# EAGLE design 3-Axis CNC Board v1.0 (EAGLE 6.5.0)
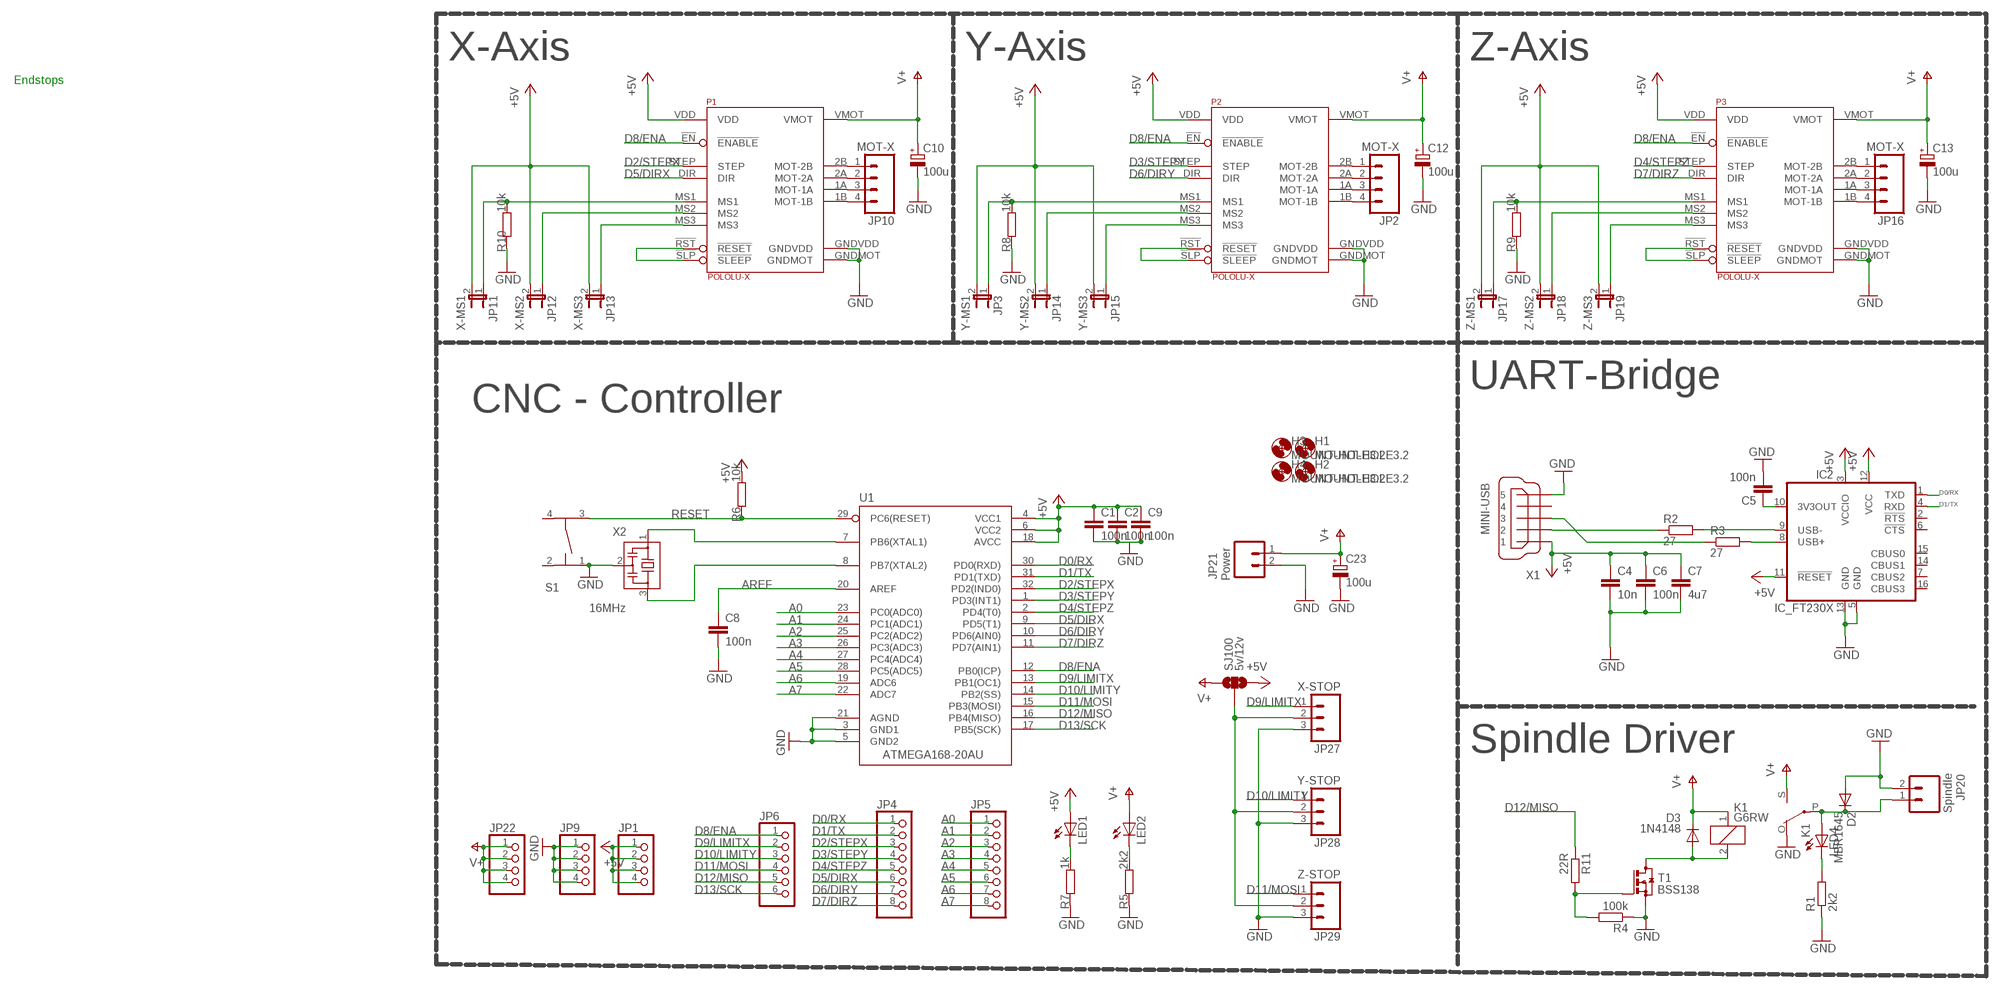
[diagram p0: schematic, sheet 1]

## Parts
C1  100n  C-EUC0805K  [C0805K]
C2  100n  C-EUC0805K  [C0805K]
C4  10n  C-EUC0805K  [C0805K]
C5  100n  C-EUC0805K  [C0805K]
C6  100n  C-EUC0805K  [C0805K]
C7  4u7  C-EUC0805K  [C0805K]
C8  100n  C-EUC0805K  [C0805K]
C9  100n  C-EUC0805K  [C0805K]
C10  100u  CPOL-EUUD-6,3X7,7  [UD-6,3X7,7_NICHICON]
C12  100u  CPOL-EUUD-6,3X7,7  [UD-6,3X7,7_NICHICON]
C13  100u  CPOL-EUUD-6,3X7,7  [UD-6,3X7,7_NICHICON]
C23  100u  CPOL-EUUD-6,3X7,7  [UD-6,3X7,7_NICHICON]
D2  MBR1645  BYT08P  [TO220ACS]
D3  1N4148  1N4148HOMO  [R0805]
H1  MOUNT-HOLE3.2  [3,2]
H2  MOUNT-HOLE3.2  [3,2]
H3  MOUNT-HOLE3.2  [3,2]
H4  MOUNT-HOLE3.2  [3,2]
IC2  IC_FT230X  IC_FT230X-SSOP-16  [SSOP-16-FTDI]
JP1  PINHD-1X4_2.54  [1X04]
JP2  MOT-X  M04POLAR  [MOLEX-1X4]
JP3  Y-MS1  JUMPER-2PTH  [1X02]
JP4  PINHD-1X8_2.54  [1X08]
JP5  PINHD-1X8_2.54  [1X08]
JP6  PINHD-1X6_2.54  [1X06]
JP9  PINHD-1X4_2.54  [1X04]
JP10  MOT-X  M04POLAR  [MOLEX-1X4]
JP11  X-MS1  JUMPER-2PTH  [1X02]
JP12  X-MS2  JUMPER-2PTH  [1X02]
JP13  X-MS3  JUMPER-2PTH  [1X02]
JP14  Y-MS2  JUMPER-2PTH  [1X02]
JP15  Y-MS3  JUMPER-2PTH  [1X02]
JP16  MOT-X  M04POLAR  [MOLEX-1X4]
JP17  Z-MS1  JUMPER-2PTH  [1X02]
JP18  Z-MS2  JUMPER-2PTH  [1X02]
JP19  Z-MS3  JUMPER-2PTH  [1X02]
JP20  Spindle  M025MM  [SCREWTERMINAL-5MM-2]
JP21  Power  M025MM  [SCREWTERMINAL-5MM-2]
JP22  PINHD-1X4_2.54  [1X04]
JP27  X-STOP  M03POLAR  [MOLEX-1X3]
JP28  Y-STOP  M03POLAR  [MOLEX-1X3]
JP29  Z-STOP  M03POLAR  [MOLEX-1X3]
K1  G6RW  [G6RW]
LED1  LEDCHIPLED_1206  [CHIPLED_1206]
LED2  LEDCHIPLED_1206  [CHIPLED_1206]
LED4  LEDCHIPLED_1206  [CHIPLED_1206]
P1  POLOLU-X  POLOLU-ALLEGRO  [POLOLU-ALLEGRO-PTH]
P2  POLOLU-X  POLOLU-ALLEGRO  [POLOLU-ALLEGRO-PTH]
P3  POLOLU-X  POLOLU-ALLEGRO  [POLOLU-ALLEGRO-PTH]
R1  2k2  R-EU_R1206  [R1206]
R2  27  R-EU_R1206  [R1206]
R3  27  R-EU_R1206  [R1206]
R4  100k  R-EU_R1206  [R1206]
R5  2k2  R-EU_R1206  [R1206]
R6  10k  R-EU_R1206  [R1206]
R7  1k  R-EU_R1206  [R1206]
R8  10k  R-EU_R1206  [R1206]
R9  10k  R-EU_R1206  [R1206]
R10  10k  R-EU_R1206  [R1206]
R11  22R  R-EU_R1206  [R1206]
S1  TASTER-9314_SMD  [TASTER-9314_SMD]
SJ100  5v/12v  SOLDERJUMPER_2WAYS  [SJ_3]
T1  BSS138  [SOT23-5L]
U1  ATMEGA168-20AU  [QFP032]
X1  MINI-USB  MINI-USB-32005-021-NODRILL  [32005-201_1]
X2  16MHz  CSTCE_G8M00G52A  [CSTCE_]

## Nets
+5V: C1.1 C2.1 C4.1 C6.1 C7.1 C9.1 IC2.3(VCCIO) IC2.11(!RESET) IC2.12(VCC) JP1.1 JP1.2 JP1.3 JP1.4 JP3.2 JP11.2 JP12.2 JP13.2 JP14.2 JP15.2 JP17.2 JP18.2 JP19.2 LED1.A P1.VDD P2.VDD P3.VDD R6.2 SJ100.3 U1.4(VCC1) U1.6(VCC2) U1.18(AVCC) X1.1
A0: JP5.1 U1.23(PC0(ADC0))
A1: JP5.2 U1.24(PC1(ADC1))
A2: JP5.3 U1.25(PC2(ADC2))
A3: JP5.4 U1.26(PC3(ADC3))
A4: JP5.5 U1.27(PC4(ADC4))
A5: JP5.6 U1.28(PC5(ADC5))
A6: JP5.7 U1.19(ADC6)
A7: JP5.8 U1.22(ADC7)
AREF: C8.1 U1.20(AREF)
D0/RX: IC2.1(TXD) JP4.1 U1.30(PD0(RXD))
D1/TX: IC2.4(RXD) JP4.2 U1.31(PD1(TXD))
D2/STEPX: JP4.3 P1.STEP U1.32(PD2(IND0))
D3/STEPY: JP4.4 P2.STEP U1.1(PD3(INT1))
D4/STEPZ: JP4.5 P3.STEP U1.2(PD4(T0))
D5/DIRX: JP4.6 P1.DIR U1.9(PD5(T1))
D6/DIRY: JP4.7 P2.DIR U1.10(PD6(AIN0))
D7/DIRZ: JP4.8 P3.DIR U1.11(PD7(AIN1))
D8/ENA: JP6.1 P1.!EN(!ENABLE) P2.!EN(!ENABLE) P3.!EN(!ENABLE) U1.12(PB0(ICP))
D9/LIMITX: JP6.2 JP27.1 U1.13(PB1(OC1))
D10/LIMITY: JP6.3 JP28.1 U1.14(PB2(SS))
D11/MOSI: JP6.4 JP29.1 U1.15(PB3(MOSI))
D12/MISO: JP6.5 R11.1 U1.16(PB4(MISO))
D13/SCK: JP6.6 U1.17(PB5(SCK))
D+: IC2.8(USB+) R3.2
D-: IC2.9(USB-) R2.2
ENDSTOP+V: JP27.2 JP28.2 JP29.2 SJ100.2
GND: C1.2 C2.2 C4.2 C5.2 C6.2 C7.2 C8.2 C9.2 C10.- C12.- C13.- C23.- D2.A IC2.5(GND) IC2.13(GND) JP9.1 JP9.2 JP9.3 JP9.4 JP20.2 JP21.2 JP27.3 JP28.3 JP29.3 K1.O(2:O) P1.GNDMOT P1.GNDVDD P2.GNDMOT P2.GNDVDD P3.GNDMOT P3.GNDVDD R1.1 R4.1 R5.1 R7.1 R8.1 R9.1 R10.1 S1.1 T1.5(S) U1.3(GND1) U1.5(GND2) U1.21(AGND) X1.5 X2.2
N$1: U1.8(PB7(XTAL2)) X2.3
N$2: U1.7(PB6(XTAL1)) X2.1
N$4: R3.1 X1.3
N$5: D3.A K1.2 T1.2(D)
N$6: D2.C JP20.1 K1.P(2:P) LED4.A
N$7: LED1.C R7.2
N$8: C5.1 IC2.10(3V3OUT)
N$9: R2.1 X1.2
N$10: LED4.C R1.2
N$11: R4.2 R11.2 T1.4(G)
N$17: LED2.C R5.2
RESET: R6.1 S1.3 U1.29(PC6(RESET))
V+: C10.+ C12.+ C13.+ C23.+ D3.K(C) JP21.1 JP22.1 JP22.2 JP22.3 JP22.4 K1.1 K1.S(2:S) LED2.A P1.VMOT P2.VMOT P3.VMOT SJ100.1
X-MOT-1A [power]: JP10.3 P1.1A(MOT-1A)
X-MOT-1A1 [power]: JP2.3 P2.1A(MOT-1A)
X-MOT-1A2 [power]: JP16.3 P3.1A(MOT-1A)
X-MOT-1B [power]: JP10.4 P1.1B(MOT-1B)
X-MOT-1B1 [power]: JP2.4 P2.1B(MOT-1B)
X-MOT-1B2 [power]: JP16.4 P3.1B(MOT-1B)
X-MOT-2A [power]: JP10.2 P1.2A(MOT-2A)
X-MOT-2A1 [power]: JP2.2 P2.2A(MOT-2A)
X-MOT-2A2 [power]: JP16.2 P3.2A(MOT-2A)
X-MOT-2B [power]: JP10.1 P1.2B(MOT-2B)
X-MOT-2B1 [power]: JP2.1 P2.2B(MOT-2B)
X-MOT-2B2 [power]: JP16.1 P3.2B(MOT-2B)
X-MS1: JP11.1 P1.MS1 R10.2
X-MS2: JP12.1 P1.MS2
X-MS3: JP13.1 P1.MS3
X-MS4: JP14.1 P2.MS2
X-MS5: JP15.1 P2.MS3
X-MS6: JP3.1 P2.MS1 R8.2
X-MS7: JP18.1 P3.MS2
X-MS8: JP19.1 P3.MS3
X-MS9: JP17.1 P3.MS1 R9.2
X-RESETSLEEP: P1.!RST(!RESET) P1.!SLP(!SLEEP)
X-RESETSLEEP1: P2.!RST(!RESET) P2.!SLP(!SLEEP)
X-RESETSLEEP2: P3.!RST(!RESET) P3.!SLP(!SLEEP)
Unconnected: IC2.2(!RTS) IC2.6(!CTS) IC2.7(CBUS2) IC2.14(CBUS1) IC2.15(CBUS0) IC2.16(CBUS3) S1.2 S1.4 X1.4

## Notes on the sheet
- X-Axis | Y-Axis | Z-Axis
- Endstops
- UART-Bridge
- CNC - Controller
- Spindle Driver

## Library data of the parts
C1 C2 C4-C9 = rcl:C-EU: CAPACITOR, European symbol
C10 C12 C13 C23 = rcl:CPOL-EU: POLARIZED CAPACITOR, European symbol
D2 = diode:BYT08P: DIODE ultra fast
D3 = belichter:1N4148: DIODE standard rectifier, 3 A, 50 V (Motorola)
H1-H4 = holes:MOUNT-HOLE: MOUNTING HOLE with drill center marker
IC2 = dp_devices:IC_FT230X: BASIC USB to UART IC
JP1 JP9 JP22 = pinhead-1:PINHD-1X4: PIN HEADER
JP2 JP10 JP16 = SparkFun:M04: Header 4 Standard 4-pin 0.1" header. Use with straight break away headers (SKU : PRT-00116), right angle break away headers (PRT-00553), swiss pins (PRT-00743), machine pins (PRT-00117), and female headers (PRT-00115). Molex polarized connector foot print use with SKU : PRT-08231 with associated crimp pins and housings.
JP3 JP11-JP15 JP17-JP19 = SparkFun:JUMPER-2: Jumper Basic 0.1" spaced jumper. Use with breakaway headers.
JP4 JP5 = pinhead-1:PINHD-1X8: PIN HEADER
JP6 = pinhead-1:PINHD-1X6: PIN HEADER
JP20 JP21 = SparkFun-Connectors:M02: Standard 2-pin 0.1" header. Use with - straight break away headers ( PRT-00116) - right angle break away headers (PRT-00553) - swiss pins (PRT-00743) - machine pins (PRT-00117) - female headers (PRT-00115) Molex polarized connector foot print use with: PRT-08233 with associated crimp pins and housings. 2.54_SCREWTERM for use with PRT-10571. 3.5mm Screw Terminal footprints for PRT-08084 5mm Screw Terminal footprints for use with PRT-08433
JP27-JP29 = SparkFun:M03: Header 3 Standard 3-pin 0.1" header. Use with straight break away headers (SKU : PRT-00116), right angle break away headers (PRT-00553), swiss pins (PRT-00743), machine pins (PRT-00117), and female headers (PRT-00115). Molex polarized connector foot print use with SKU : PRT-08232 with associated crimp pins and housings.
K1 = relay:G6RW: RELAY 1 x switch, Omron; OC_FARNELL: unknown; OC_NEWARK: unknown
LED1 LED2 LED4 = led:LED: LED OSRAM: - CHIPLED LG R971, LG N971, LY N971, LG Q971, LY Q971, LO R971, LY R971 LH N974, LH R974 LS Q976, LO Q976, LY Q976 LO Q996 - Hyper CHIPLED LW Q18S LB Q993, LB Q99A, LB R99A - SideLED LS A670, LO A670, LY A670, LG A670, LP A670 LB A673, LV A673, LT A673, LW A673 LH A674 LY A675 LS A676, LA A676, LO A676, LY A676, LW A676 LS A679, LY A679, LG A679 - Hyper Micro SIDELED® LS Y876, LA Y876, LO Y876, LY Y876 LT Y87S - SmartLED LW L88C, LW L88S LB L89C, LB L89S, LG L890 LS L89K, LO L89K, LY L89K LS L896, LA L896, LO L896, LY L896 - TOPLED LS T670, LO T670, LY T670, LG T670, LP T670 LSG T670, LSP T670, LSY T670, LOP T670, LYG T670 LG T671, LOG T671, LSG T671 LB T673, LV T673, LT T673, LW T673 LH T674 LS T676, LA T676, LO T676, LY T676, LB T676, LH T676, LSB T676, LW T676 LB T67C, LV T67C, LT T67C, LS T67K, LO T67K, LY T67K, LW E67C LS E67B, LA E67B, LO E67B, LY E67B, LB E67C, LV E67C, LT E67C LW T67C LS T679, LY T679, LG T679 LS T770, LO T770, LY T770, LG T770, LP T770 LB T773, LV T773, LT T773, LW T773 LH T774 LS E675, LA E675, LY E675, LS T675 LS T776, LA T776, LO T776, LY T776, LB T776 LHGB T686 LT T68C, LB T68C - Hyper Mini TOPLED® LB M676 - Mini TOPLED Santana® LG M470 LS M47K, LO M47K, LY M47K Source: http://www.osram.convergy.de LUXEON: - LUMILED® LXK2-PW12-R00, LXK2-PW12-S00, LXK2-PW14-U00, LXK2-PW14-V00 LXK2-PM12-R00, LXK2-PM12-S00, LXK2-PM14-U00 LXK2-PE12-Q00, LXK2-PE12-R00, LXK2-PE12-S00, LXK2-PE14-T00, LXK2-PE14-U00 LXK2-PB12-K00, LXK2-PB12-L00, LXK2-PB12-M00, LXK2-PB14-N00, LXK2-PB14-P00, LXK2-PB14-Q00 LXK2-PR12-L00, LXK2-PR12-M00, LXK2-PR14-Q00, LXK2-PR14-R00 LXK2-PD12-Q00, LXK2-PD12-R00, LXK2-PD12-S00 LXK2-PH12-R00, LXK2-PH12-S00 LXK2-PL12-P00, LXK2-PL12-Q00, LXK2-PL12-R00 Source: www.luxeon.com KINGBRIGHT: KA-3528ASYC Source: www.kingbright.com
P1-P3 = pololu-allegro:POLOLU-ALLEGRO
R1-R11 = rcl:R-EU_: RESISTOR, European symbol
S1 = SMD-taster:TASTER-9314_SMD
SJ100 = SparkFun:SOLDERJUMPER_2WAY: Solder Jumper 2 way solder jumper
T1 = belichter:BSS138
U1 = MySMD:ATMEGA168-20AU
X1 = con-cypressindustries:MINI-USB-: MINI USB-B Conector Source: www.cypressindustries.com
X2 = DragonLib:CSTCE_G: Resonator Source: murata.co.jp; MPN: CSTCE8M00G52-R0; OC_RS: 721-4827

## Board
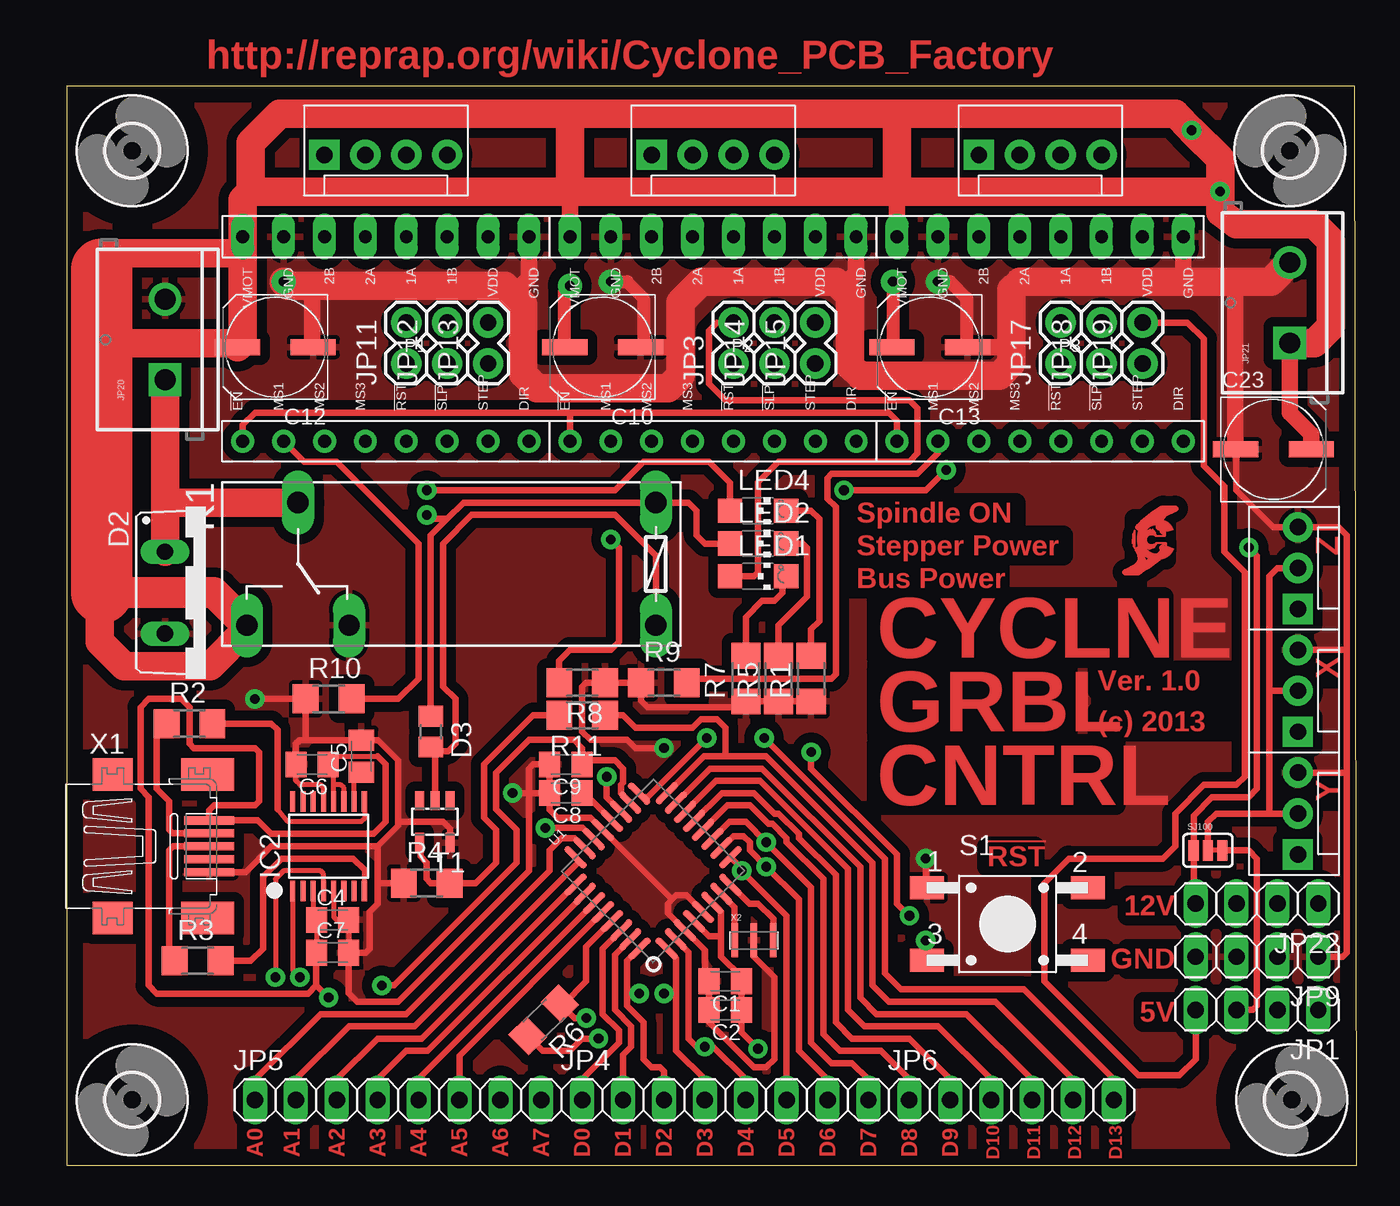
[diagram p1: board, top side]
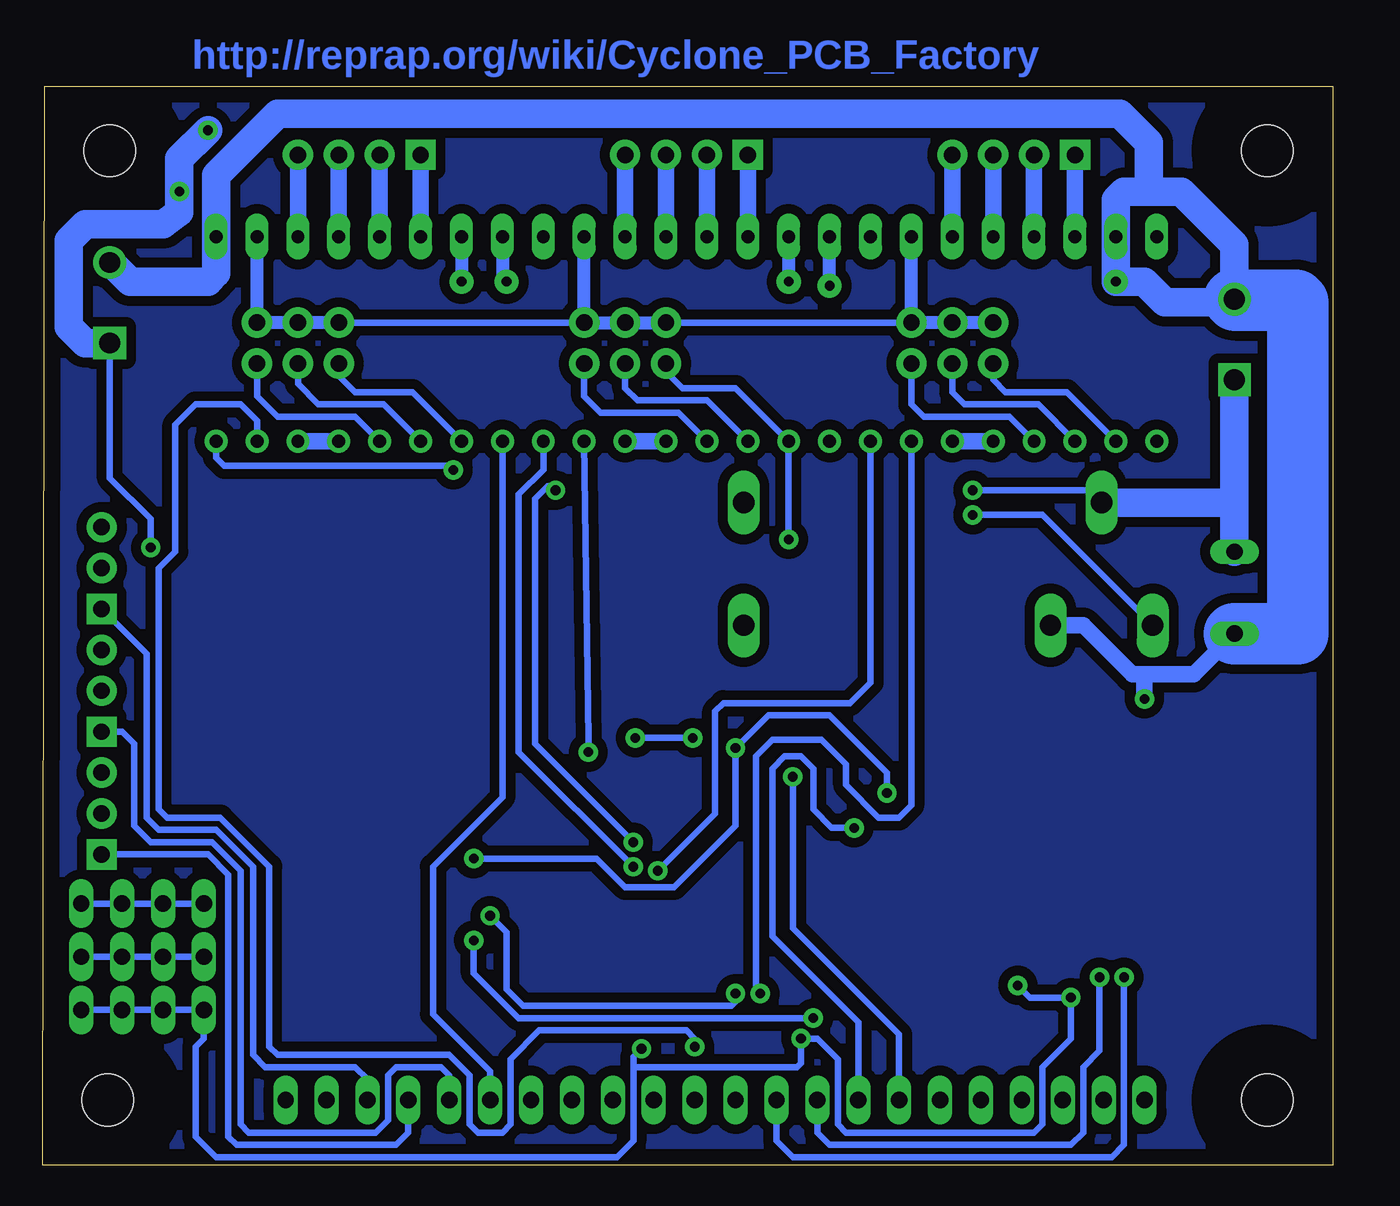
[diagram p2: board, bottom side, seen from below]

Size 80.12 x 66.98 mm. Coordinates in mm from the lower left corner, seen from the top.
Outline: 0,0 80.12,0 79.99,66.98 0,66.98 0,0
Copper layers (1*16): Top 0.035mm / dielectric 1.5mm / Bottom 0.035mm
Design rules "default *": minimum track width 10mil, minimum drill 24mil, track to track 2mil, track to pad 2mil, pad to pad 2mil, via to via 2mil, smd to smd 2mil, copper to edge 40mil, drill to drill 2mil, minimum pad ring 10mil, minimum via ring 8mil, stop-mask expansion 4mil, vias tented up to drill 0mil, thermal gap 10mil

### Footprints (pad centres in the part's own frame; a part is rotated, then mirrored left to right if it is on the bottom)
C0805K = smd 1.3 x 1.6: 1 -1,0; 2 1,0
UD-6,3X7,7_NICHICON = smd 2.8 x 1: + 2.35,0; - -2.35,0
TO220ACS = drill 1.016 long: A 2.54,-2.54; C -2.54,-2.54
R0805 = smd 1.3 x 1.5: A 0.95,0; K -0.95,0
3,2 = hole 3.2: 0,0
SSOP-16-FTDI = smd 0.32 x 1.26: 1 -2.223,-2.779; 2 -1.588,-2.779; 3 -0.953,-2.779; 4 -0.318,-2.779; 5 0.317,-2.779; 6 0.952,-2.779; 7 1.587,-2.779; 8 2.222,-2.779; 9 2.222,2.779; 10 1.587,2.779; 11 0.952,2.779; 12 0.317,2.779; 13 -0.318,2.779; 14 -0.953,2.779; 15 -1.588,2.779; 16 -2.223,2.779
1X04 = drill 1.016 long: 1 -3.81,0; 2 -1.27,0; 3 1.27,0; 4 3.81,0
MOLEX-1X4 = drill 1.016 pad 1.88 square: 1 0,0 | drill 1.016 pad 1.88: 2 2.54,0; 3 5.08,0; 4 7.62,0
1X02 = drill 1.016 pad 1.88: 1 0,0; 2 2.54,0
1X08 = drill 1.016 long: 1 -8.89,0; 2 -6.35,0; 3 -3.81,0; 4 -1.27,0; 5 1.27,0; 6 3.81,0; 7 6.35,0; 8 8.89,0
1X06 = drill 1.016 long: 1 -6.35,0; 2 -3.81,0; 3 -1.27,0; 4 1.27,0; 5 3.81,0; 6 6.35,0
SCREWTERMINAL-5MM-2 = drill 1.3 pad 2.032 square: 1 0,0 | drill 1.3 pad 2.032: 2 5,0
MOLEX-1X3 = drill 1.016 pad 1.88 square: 1 0,0 | drill 1.016 pad 1.88: 2 2.54,0; 3 5.08,0
G6RW = drill 1.321 long: 1 -12.7,-3.81; 2 -12.7,3.81; O 6.35,3.81; P 9.525,-3.81; S 12.7,3.81
CHIPLED_1206 = smd 1.5 x 1.5: A 0,-1.75; C 0,1.75
POLOLU-ALLEGRO-PTH = drill 0.8 pad 1.422 long: 1A 6.35,-1.27; 1B 6.35,-3.81; 2A 6.35,1.27; 2B 6.35,3.81; GNDMOT 6.35,6.35; GNDVDD 6.35,-8.89; VDD 6.35,-6.35; VMOT 6.35,8.89 | drill 0.8 pad 1.422: !EN -6.35,8.89; !RST -6.35,-1.27; !SLP -6.35,-3.81; DIR -6.35,-8.89; MS1 -6.35,6.35; MS2 -6.35,3.81; MS3 -6.35,1.27; STEP -6.35,-6.35
R1206 = smd 1.6 x 1.803: 1 -1.422,0; 2 1.422,0
TASTER-9314_SMD = smd 2.1 x 1.4: 1 -5,2.25; 2 5,2.25; 3 -5,-2.25; 4 5,-2.25
SJ_3 = smd 0.635 x 1.27: 1 -0.889,0; 2 0,0; 3 0.889,0
SOT23-5L = smd 0.55 x 1.2: 1 -0.95,-1.3; 2 0,-1.3; 3 0.95,-1.3; 4 0.95,1.3; 5 -0.95,1.3
QFP032 = smd 0.432 x 1.778: 1 0,0; 2 0.8,0; 3 1.599,0; 4 2.399,0; 5 3.199,0; 6 3.998,0; 7 4.798,0; 8 5.598,0; 17 5.588,8.001; 18 4.798,7.997; 19 3.998,7.997; 20 3.199,7.997; 21 2.399,7.997; 22 1.599,7.997; 23 0.799,7.997; 24 0,7.997 | smd 1.778 x 0.432: 9 6.807,1.194; 10 6.807,2.007; 11 6.807,2.794; 12 6.807,3.607; 13 6.807,4.394; 14 6.807,5.182; 15 6.807,5.994; 16 6.816,6.803; 25 -1.194,6.807; 26 -1.194,5.994; 27 -1.194,5.182; 28 -1.194,4.394; 29 -1.194,3.607; 30 -1.194,2.794; 31 -1.194,2.007; 32 -1.194,1.194
32005-201_1 = smd 3.1 x 0.5: 1 3,1.6; 2 3,0.8; 3 3,0; 4 3,-0.8; 5 3,-1.6 | smd 2.5 x 2: M1 -3,-4.45; M2 -3,4.45 | smd 3.3 x 2: M3 2.9,4.45; M4 2.9,-4.45
CSTCE_ = smd 0.4 x 2.1: 1 -1.2,0; 2 0,0; 3 1.2,0

### Placement (x,y rotation side)
C1  40.89,11.43 180 top
C2  40.89,9.65 180 top
C4  16.51,15.24 0 top
C5  18.29,25.4 90 top
C6  15.24,24.89 180 top
C7  16.51,13.21 0 top
C8  30.99,23.11 180 top
C9  30.99,24.89 180 top
C10  33.27,50.8 180 top
C12  12.95,50.8 180 top
C13  53.59,50.8 180 top
C23  74.93,44.45 0 top
D2  8.64,35.56 270 top
D3  22.61,26.92 270 top
H1  75.95,62.99 90 top
H2  4.06,62.99 0 top
H3  76.07,4.06 0 top
H4  4.06,4.06 0 top
IC2  16.26,19.81 0 top
JP1  73.91,9.65 180 top
JP2  36.32,62.74 0 top
JP3  41.4,49.78 90 top
JP4  40.89,4.06 0 top
JP5  20.57,4.06 0 top
JP6  58.67,4.06 0 top
JP9  73.91,12.95 180 top
JP10  16,62.74 0 top
JP11  21.08,49.78 90 top
JP12  23.62,49.78 90 top
JP13  26.16,49.78 90 top
JP14  43.94,49.78 90 top
JP15  46.48,49.78 90 top
JP16  56.64,62.74 0 top
JP17  61.72,49.78 90 top
JP18  64.26,49.78 90 top
JP19  66.8,49.78 90 top
JP20  6.1,48.77 90 top
JP21  75.95,51.05 90 top
JP22  73.91,16.26 180 top
JP27  76.45,26.92 90 top
JP28  76.45,19.3 90 top
JP29  76.45,34.54 90 top
K1  23.88,37.34 180 top
LED1  42.93,36.58 270 top
LED2  42.93,38.61 270 top
LED4  42.93,40.64 270 top
P1  19.81,51.31 90 top
P2  40.13,51.31 90 top
P3  60.45,51.31 90 top
R1  46.23,30.23 90 top
R2  7.62,27.43 0 top
R3  8.13,12.7 0 top
R4  22.35,17.53 0 top
R5  44.2,30.23 90 top
R6  29.61,9.04 225 top
R7  42.16,30.23 90 top
R8  32,29.97 180 top
R9  37.08,29.97 0 top
R10  16.26,28.96 0 top
R11  32,27.94 180 top
S1  58.42,14.99 0 top
SJ100  70.87,19.56 0 top
T1  22.86,21.34 180 top
U1  37.25,13.47 45 top
X1  5.84,19.81 0 top
X2  42.67,13.97 0 top

### Tracks (layer width: path | path; a pad name or v marks a point on that pad's centre or on a via)
+5V  (via drill 0.6 pad 1.2)
  Top 0.305: IC2.3 15.3,15.45 C4.1 C7.1 | IC2.12 16.57,23.62 | 16.57,23.62 16.57,24.56 C6.1 16.24,25.13 16.51,25.4 19.3,25.4 | IC2.11 17.21,23.43 17.02,23.62 16.57,23.62 | SJ100.3 70.87,19.56
  Top 0.406: U1.6 40.64,15.73 40.64,14.22 | U1.4 39.89,14.22 40.64,14.22 | 40.64,14.22 40.64,12.95 41.89,11.7 C1.1 C2.1 41.91,9.64 41.91,8.26 v42.93,7.24 | U1.18 34.42,23.09 34.42,23.62 34.54,23.75 34.54,24.64 34.04,25.15 32.51,25.15 32.26,24.89 C9.1 32,24.91 32,25.91 31.5,26.42 28.7,26.42 26.67,24.38 26.67,22.1 27.94,20.83 27.94,18.8 20.32,11.18 v19.56,11.18 | R6.2 29.53,7.11 31.24,7.11 32,7.87 v33.02,7.87 | 19.3,25.4 19.81,24.89 19.81,21.34 19.05,20.57 12.7,20.57 11.86,21.41 X1.1 8.84,22.05 9.14,22.35 11.68,22.35 11.94,22.61 11.94,25.65 11.68,25.91 7.87,25.91 7.62,26.16 7.62,28.45 7.11,28.96 5.08,28.96 4.57,28.45 4.57,23.37 5.08,22.86 5.08,11.18 5.59,10.67 14.99,10.67 15.49,11.18 | 15.49,11.18 15.49,13.19 C7.1 | 15.49,11.18 v16.26,10.41 | SJ100.3 73.41,19.56 73.91,19.05 73.91,9.91 73.66,9.65 JP1.3 | JP3.2 40.39,52.32 39.88,51.82 39.88,48.51 40.89,47.5 52.32,47.5 52.83,46.99 52.83,44.2 52.32,43.69 44.2,43.69 42.93,42.42 42.93,36.83 42.67,36.58 LED1.A | JP1.4 70.1,6.6 69.09,5.59 66.55,5.59 60.71,11.43 60.71,17.53 62.23,19.05 68.07,19.05 68.83,19.81 68.83,21.84 70.61,23.62 72.64,23.62 73.15,24.13 73.15,36.83 71.88,38.1 71.88,42.16 70.61,43.43 70.61,51.31 69.6,52.32 JP19.2
  Bottom 0.406: v19.56,11.18 18.8,10.41 v16.26,10.41 16.26,7.87 18.03,6.1 18.03,2.54 18.54,2.03 30.23,2.03 30.73,2.54 30.73,6.6 32,7.87 v33.02,7.87 33.02,6.35 33.27,6.1 43.43,6.1 | v42.93,7.24 43.43,6.73 43.43,6.1 | 43.43,6.1 43.43,1.52 44.45,0.51 69.34,0.51 70.61,1.78 70.61,7.37 70.1,7.87 JP1.4 JP1.3 JP1.2 JP1.1 | JP13.2 JP3.2 | JP15.2 JP17.2
  Bottom 0.813: JP17.2 JP18.2 JP19.2 P3.VDD | JP3.2 JP14.2 JP15.2 P2.VDD | JP11.2 JP12.2 JP13.2 P1.VDD
A0
  Top 0.406: JP5.1 11.68,5.33 15.75,9.4 21.08,9.4 29.97,18.29 29.97,19.56 30.73,20.32 31.53,20.32 U1.23
A1
  Top 0.406: U1.24 31.75,18.97 31.75,18.8 21.59,8.64 17.53,8.64 14.22,5.33 JP5.2
A2
  Top 0.406: U1.25 22.03,7.87 19.3,7.87 16.76,5.33 JP5.3
A3
  Top 0.406: U1.26 22.42,7.11 21.08,7.11 19.3,5.33 JP5.4
A4
  Top 0.406: U1.27 21.84,5.39 JP5.5
A5
  Top 0.406: U1.28 24.38,6.82 JP5.6
A6  (via drill 0.6 pad 1.2)
  Top 0.406: U1.19 33.53,22.85 v33.53,24.13
  Bottom 0.406: v33.53,24.13 33.53,14.73 26.92,8.13 JP5.7
A7  (via drill 0.6 pad 1.2)
  Top 0.406: U1.22 32.03,20.95 v29.72,20.95
  Bottom 0.406: v29.72,20.95 31.11,20.95 32.26,22.1 32.26,24.64 33.02,25.4 34.04,25.4 34.8,24.64 34.8,14.22 29.46,8.89 JP5.8
AREF
  Top 0.406: U1.20 32.24,23 C8.1
D0/RX  (via drill 0.6 pad 1.2)
  Top 0.305: IC2.1 14.03,12.13 v14.48,11.68
  Top 0.406: JP4.1 32,5.33 34.29,7.62 34.29,8.38 33.27,9.4 33.27,13.46 34.41,14.6 U1.30
  Bottom 0.406: v14.48,11.68 14.48,7.11 15.49,6.1 15.49,2.03 16.26,1.27 31.24,1.27 32,2.03 JP4.1
D1/TX  (via drill 0.6 pad 1.2)
  Top 0.305: IC2.4 15.94,18.1 15.75,18.29 13.46,18.29 12.95,17.78 v12.95,11.68
  Top 0.406: U1.31 34.04,13.09 34.04,9.65 35.05,8.64 35.05,7.37 34.54,6.86 JP4.2
  Bottom 0.406: v12.95,11.68 12.95,1.27 13.72,0.51 33.53,0.51 34.54,1.52 JP4.2
D2/STEPX  (via drill 0.6 pad 1.2)
  Top 0.406: U1.32 34.8,12.71 34.8,10.67 | 34.8,10.67 34.8,9.91 35.81,8.89 35.81,6.6 36.32,6.1 36.83,6.1 37.08,5.84 JP4.3 | v35.56,10.67 34.8,10.67
  Bottom 0.406: P1.STEP 26.16,22.35 26.92,21.59 28.19,21.59 30.23,23.62 30.23,24.89 31.75,26.42 34.8,26.42 35.81,25.4 35.81,10.92 v35.56,10.67
D3/STEPY  (via drill 0.6 pad 1.2)
  Top 0.406: JP4.4 39.62,5.33 37.85,7.11 37.85,10.67 | 37.85,10.67 37.85,12.87 U1.1 | 37.85,10.67 v37.08,10.67 | v52.32,15.49 51.56,16.26 51.56,19.3 46.23,24.64 v46.23,25.65
  Bottom 0.406: P2.STEP 46.23,26.42 v46.23,25.65 | v37.08,10.67 37.08,10.16 37.34,9.91 50.29,9.91 51.31,10.92 51.31,14.48 v52.32,15.49
D4/STEPZ  (via drill 0.6 pad 1.2)
  Top 0.406: JP4.5 42.16,5.33 40.13,7.37 v39.62,7.37 39.12,7.37 38.61,7.87 38.61,13.24 U1.2
  Bottom 0.406: v39.62,7.37 39.62,7.87 40.13,8.38 49.28,8.38 51.05,6.6 51.05,2.54 51.56,2.03 53.09,2.03 53.59,2.54 53.59,5.59 54.86,6.86 65.53,6.86 66.04,7.37 66.04,18.54 69.09,21.59 72.39,21.59 72.9,22.1 72.9,37.08 71.88,38.1 71.88,45.97 70.61,47.24 67.82,47.24 66.8,46.23 P3.STEP
D5/DIRX  (via drill 0.6 pad 1.2)
  Top 0.406: U1.9 41.91,18.44 v41.91,18.29 44.7,15.49 JP4.6
  Bottom 0.406: P1.DIR 28.7,29.97 29.97,28.7 37.85,28.7 38.35,28.19 38.35,21.84 v41.91,18.29
D6/DIRY  (via drill 0.6 pad 1.2)
  Top 0.406: JP4.7 47.24,5.33 45.47,7.11 45.47,16.51 v43.43,18.54 42.42,19.56 42.42,20.07 42.04,20.45 41.39,20.45 U1.10
  Bottom 0.406: v43.43,18.54 50.55,25.65 50.55,41.66 49.02,43.18 P2.DIR
D7/DIRZ  (via drill 0.6 pad 1.2)
  Top 0.406: JP4.8 49.78,5.33 48.77,6.35 47.5,6.35 46.23,7.62 46.23,17.27 v43.43,20.07 42.16,21.34 41.17,21.34 U1.11 | v54.61,43.18 53.34,41.91 v48.26,41.91
  Bottom 0.406: v43.43,20.07 49.53,26.16 49.53,41.4 48.77,42.16 v48.26,41.91 | P3.DIR 69.34,43.94 68.83,43.43 54.86,43.43 v54.61,43.18
D8/ENA
  Top 0.406: P1.!EN 10.92,45.97 11.68,46.74 31.24,46.74 | 31.24,46.74 51.05,46.74 51.56,46.23 P3.!EN | P2.!EN 31.24,46.74 | JP6.1 52.32,5.33 50.55,7.11 48.01,7.11 46.99,8.13 46.99,17.78 44.7,20.07 44.7,20.32 43.81,21.21 43.56,21.21 42.42,22.35 41.03,22.35 U1.12
  Bottom 0.406: P3.!EN 51.56,22.86 55.88,18.54 55.88,9.4 52.32,5.84 JP6.1
D9/LIMITX
  Top 0.406: JP6.2 54.86,5.33 52.32,7.87 48.77,7.87 47.75,8.89 47.75,18.03 45.47,20.32 45.47,20.57 44.2,21.84 43.94,21.84 42.67,23.11 40.68,23.11 U1.13
  Bottom 0.406: JP27.1 75.18,26.92 74.42,26.16 74.42,21.08 73.41,20.07 69.6,20.07 67.82,18.29 67.82,2.54 67.31,2.03 59.44,2.03 58.67,2.79 58.67,5.59 58.17,6.1 55.37,6.1 54.86,5.59 JP6.2
D10/LIMITY
  Top 0.406: JP6.3 57.4,5.33 54.1,8.64 49.53,8.64 48.51,9.65 48.51,18.41 43.05,23.88 40.33,23.88 U1.14
  Bottom 0.406: JP28.1 69.85,19.3 68.58,18.03 68.58,1.78 68.07,1.27 58.17,1.27 57.4,2.03 JP6.3
D11/MOSI
  Top 0.406: JP6.4 59.94,5.33 55.88,9.4 50.29,9.4 49.28,10.41 49.28,18.54 43.18,24.64 39.94,24.64 U1.15
  Bottom 0.406: JP29.1 73.66,31.75 73.66,21.59 72.9,20.83 69.34,20.83 67.06,18.54 67.06,6.86 66.29,6.1 60.71,6.1 59.94,5.33 JP6.4
D12/MISO
  Top 0.406: JP6.5 62.48,5.33 57.66,10.16 51.05,10.16 50.04,11.18 50.04,18.8 43.43,25.4 40.89,25.4 | 40.89,25.4 39.56,25.4 U1.16 | 40.89,25.4 40.89,27.18 40.39,27.69 39.37,27.69 38.86,27.18 35.31,27.18 34.54,27.94 R11.1
D13/SCK  (via drill 0.6 pad 1.2)
  Top 0.406: JP6.6 65.02,5.33 59.44,10.92 51.82,10.92 50.8,11.94 50.8,19.05 v43.31,26.54 | v39.75,26.54 36.07,22.86 35.76,22.86 U1.17
  Bottom 0.406: v39.75,26.54 v43.31,26.54
D+
  Top 0.305: IC2.8 18.48,18.35 18.29,18.54
  Top 0.406: R3.2 11.43,12.7 12.19,13.46 12.19,17.91 13.34,19.05 17.78,19.05 18.48,18.35
D-
  Top 0.305: IC2.9 18.48,21.53 18.29,21.34 13.72,21.34 13.08,22.1
  Top 0.406: 13.08,22.1 13.08,27.05 12.7,27.43 R2.2
ENDSTOP+V
  Top 0.406: JP28.2 74.68,21.84 | 74.68,21.84 71.37,21.84 70.87,21.34 SJ100.2 | 74.68,21.84 74.68,29.46 | 74.68,29.46 74.68,36.58 75.18,37.08 JP29.2 | JP27.2 74.68,29.46
GND  (via drill 0.6 pad 1.2, 0.6 pad 1.5)
  Top 0.305: IC2.5 16.57,15.43 16.76,15.24 C4.2 C7.2 | IC2.13 15.94,23.43 15.75,23.62 14.48,23.62 14.22,23.88 14.22,24.88 C6.2
  Top 0.406: U1.5 38.48,16.76 37.85,16.76 37.59,16.51 | 37.59,16.51 37.34,16.26 37.34,15.64 U1.3 39.62,13.36 39.62,11.94 39.89,11.67 C1.2 C2.2 39.89,8.87 42.67,6.1 43.43,6.1 43.94,6.6 43.94,11.68 42.67,12.95 X2.2 | 37.59,16.51 37.59,16.52 U1.21 32.52,21.59 30.48,21.59 29.99,22.08 C8.2 C9.2 28.96,24.89 28.7,24.64 28.7,23.11 | 20.57,21.34 20.57,25.15 19.32,26.4 C5.2 14.73,26.4 | 20.57,21.34 20.57,21.08 19.3,19.81 | 19.3,19.81 12.7,19.81 11.1,18.21 X1.5 | 19.3,17.53 19.3,16.26 18.8,15.75 18.8,13.46 18.54,13.21 C7.2 17.51,10.68 18.03,10.16 20.57,10.16 28.7,18.29 28.7,23.11 | 19.3,17.53 19.3,19.81 | 28.7,23.11 29.97,23.11 | S1.1 53.34,17.16 v53.34,19.05 | v27.69,23.11 28.7,23.11 | C23.- 72.64,44.39 72.64,41.91 74.93,39.62 JP29.3 78.99,39.62 79.5,39.12 79.5,32 | 79.5,32 79.5,24.38 | 79.5,24.38 79.5,13.21 79.25,12.95 JP9.1 | JP28.3 79.5,24.38 | JP27.3 79.5,32 | R5.1 R7.1 | R7.1 R1.1 | R4.1 19.3,17.53 | T1.5 23.81,20.89 23.37,21.34 20.57,21.34 | v37.08,25.91 35.31,25.91 34.8,26.42 32.51,26.42 32,26.92 32,29.72 32.26,29.97 R8.1 R9.1 35.66,28.85 36.07,28.45 41.81,28.45 R7.1 | 14.73,26.4 14.46,26.4 14.22,26.16 14.22,24.91 C6.2 | 14.73,26.4 14.83,26.5 R10.1 v11.68,28.96
  Top 0.813: v54.1,54.86 54.86,54.86 55.88,53.85 55.88,50.86 C13.- | v13.46,54.86 14.22,54.86 | 15.24,50.86 C12.- | v33.78,54.86 34.8,54.86 35.81,53.85 35.81,50.99 C10.-
  Top 1.016: P1.GNDVDD 28.7,55.12 27.69,54.1 | P2.GNDVDD 49.02,55.37 48.13,54.48 | C23.- 72.58,54.8 72.64,54.86 | 15.24,50.86 15.24,54.61 | C10.- 38.1,50.8 | C13.- 58.67,50.8 | P3.GNDVDD 69.34,54.86
  Top 1.778: JP21.2 74.76,54.86 72.64,54.86 69.34,54.86 59.18,54.86 58.67,54.36 58.67,50.8 58.67,49.78 57.91,49.02 49.28,49.02 48.64,49.66 48.64,53.98 48.13,54.48 47.75,54.86 39.37,54.86 38.1,53.59 38.1,50.8 38.1,49.02 37.34,48.26 29.21,48.26 28.32,49.15 28.32,53.47 27.69,54.1 27.18,54.61 15.24,54.61 13.72,54.61 v13.46,54.86
  Bottom 0.406: v27.69,23.11 27.69,24.38 31.24,27.94 35.05,27.94 v37.08,25.91 37.08,21.08 40.89,17.27 43.94,17.27 45.72,19.05 v53.34,19.05 | JP9.1 JP9.2 JP9.3 JP9.4
  Bottom 0.813: P3.GNDMOT v54.1,54.86 | P2.GNDMOT v33.78,54.86
  Bottom 1.016: K1.O 15.49,33.53 12.45,30.48 11.68,30.48 | 11.68,30.48 8.64,30.48 D2.A | v11.68,28.96 11.68,30.48
  Bottom 1.778: 11.43,60.45 12.95,60.45 13.46,59.94 P1.GNDMOT v13.46,54.86 11.68,54.86 10.41,53.59 6.27,53.59 JP20.2 6.1,57.15 9.4,60.45 11.43,60.45 | 11.43,60.45 11.43,63.5 13.21,65.28 65.53,65.28 69.34,61.47 69.34,55.37 69.85,54.86 74.68,54.86 75.95,56.13
  Bottom 3.81: JP20.2 6.05,53.72 2.29,53.72 2.16,53.59 2.16,33.02 D2.A
  pour Top (isolate 0.61): 0,0 80.01,0 80.01,67.06 0,67.06
N$1
  Top 0.406: X2.3 43.87,15.31 42.93,16.26 42.38,16.26 U1.8
N$2
  Top 0.406: U1.7 41.47,16.03 X2.1
N$3
  pour Bottom (isolate 0.61): 0,0 80.01,0 80.01,67.06 0,67.06
N$4
  Top 0.406: X1.3 6.6,19.81 6.35,19.56 6.35,13.06 R3.1
N$5
  Top 0.406: T1.2 22.86,25.72 | 22.86,25.72 D3.A | 22.86,25.72 23.69,25.72 24.13,26.16 24.13,28.96 23.37,29.72 23.37,38.61 25.15,40.39 34.04,40.39 36.58,37.85 K1.2
N$6  (via drill 0.6 pad 1.2)
  Top 0.406: LED4.A 41.18,42.39 39.88,43.69 35.81,43.69 34.04,41.91 v22.35,41.91
  Top 1.778: D2.C 6.1,41.4 | 6.1,41.4 JP20.1 | 6.1,41.4 6.35,41.15 14.48,41.15
  Bottom 0.406: v22.35,41.91 15.11,41.91 K1.P
  Bottom 1.778: JP20.1 6.1,41.15 | 6.1,41.15 D2.C | K1.P 6.1,41.15
N$7
  Top 0.406: R7.2 42.16,34.04 43.18,35.05 43.94,35.05 44.45,35.56 44.45,36.35 LED1.C
N$8
  Top 0.305: IC2.10 17.84,23.95 C5.1
N$9
  Top 0.406: X1.2 6.57,20.61 6.35,20.83 6.35,22.61 5.59,23.37 5.59,26.82 R2.1
N$10
  Top 0.406: R1.2 46.23,33.27 46.74,33.78 46.74,40.13 46.23,40.64 LED4.C
N$11
  Top 0.406: T1.4 21.97,19.98 21.97,19.18 22.35,18.8 22.35,17.78 22.61,17.53 R4.2 25.4,17.53 26.67,18.8 26.67,20.83 25.91,21.59 25.91,24.89 28.96,27.94 R11.2
N$12
  Top 0.406: 67.44,40.39 66.8,39.88 66.55,39.62 | 68.07,40.77 67.69,40.13 | 68.07,40.77 68.83,40.77 68.07,40.39 | 67.82,39.88 67.82,39.62 | 68.07,39.37 67.82,39.88 | 67.82,39.88 67.69,40.13 | 67.69,40.13 68.07,40.39 | 68.07,40.39 67.82,39.88 | 68.07,40.77 66.55,39.62 | 66.55,39.62 67.69,40.51
N$13
  Top 0.406: 67.15,37.22 67.78,37.73 68.02,38 | 66.51,36.84 66.89,37.47 | 66.51,36.84 65.75,36.84 66.51,37.22 | 66.77,37.73 66.77,37.98 | 66.51,38.23 66.77,37.73 | 66.77,37.73 66.89,37.47 | 66.89,37.47 66.51,37.22 | 66.51,37.22 66.77,37.73 | 66.51,36.84 68.02,38 | 68.02,38 66.89,37.09
N$14
  Top 0.406: 67.06,37.34 67.31,37.59
N$15
  Top 0.406: 68.1,38.23 68.02,37.98
N$16
  Top 0.406: 68.09,38.23 68.04,38.36 68.1,38.26
N$17
  Top 0.406: R5.2 44.2,33.53 45.97,35.31 45.97,38.35 45.72,38.61 LED2.C
N$18
  Top 0.406: 66.62,38.2 66.77,37.41
N$19
  Top 0.406: 66.18,36.99 66.79,37.49
N$20
  Top 0.127: 67.18,37.1 67.02,37.03
N$21
  Top 0.127: 66.76,36.85 66.97,36.97
N$22
  Top 0.127: 67.17,37.08 66.71,36.82
N$23
  Top 0.127: 67.98,40.88 67.38,40.51
N$24
  Top 0.127: 68.13,40.19 68.27,40.35
N$25
  Top 0.127: 68.04,39.64 67.99,39.98
N$26
  Top 0.127: 68.15,39.6 68.21,39.39
N$27
  Top 0.127: 68.15,39.26 68.09,39.21
N$28
  Top 0.127: 66.33,38.31 66.32,39.42
N$29
  Top 0.127: 66.26,38.44 66.28,39.32
N$30
  Top 0.127: 66.21,38.6 66.23,39.19
N$31
  Top 0.127: 67.03,39.23 67.05,39.36
N$32
  Top 0.127: 67.01,39.35 67.27,39.46
N$33
  Top 0.127: 67.22,38.28 66.99,38.4
N$34
  Top 0.127: 67.01,38.54 67.06,38.3
N$35
  Top 0.127: 67.61,39.09 68.21,39.09
N$36
  Top 0.127: 67.65,38.64 68.17,38.65 67.98,37.98
N$37
  Top 0.127: 68.14,38.54 68.12,38.55
N$38
  Top 0.127: 67.65,38.64 67.52,38.41
N$39
  Top 0.127: 67.31,38.33 67.56,38.41
N$40
  Top 0.127: 67.58,38.52 67.45,38.35
N$41
  Top 0.127: 67.19,38.31 67,38.48
N$42
  Top 0.127: 66.96,38.7 67.08,38.35
N$43
  Top 0.127: 67.28,38.31 67.07,38.37
N$44
  Top 0.127: 67.04,39.23 67.24,39.41
N$45
  Top 0.127: 66.94,38.99 67.14,39.4
N$46
  Top 0.127: 67.02,39.3 67.42,39.47
N$47
  Top 0.127: 67.55,39.3 67.38,39.43
N$48
  Top 0.127: 67.6,39.09 67.59,39.29
N$49
  Top 0.127: 67.62,39.16 67.52,39.35
N$50
  Top 0.127: 68.22,39.09 68.22,39.41
N$51
  Top 0.127: 68.19,39.17 68.15,39.19
N$52
  Top 0.127: 68.24,38.65 68.24,38.28
N$53
  Top 0.127: 68.07,38.61 68.05,38.65
N$54
  Top 0.127: 68.05,38.62 68.09,38.61 68.2,38.65
N$55
  Top 0.127: 67.52,39.38 67.36,39.41
N$56
  Top 0.127: 67.65,38.64 arc-279 67.61,39.09
N$57
  Top 0.127: 67.04,38.57 67.44,38.4 67.11,38.45
N$58
  Top 0.127: 67.07,39.16 67.4,39.38 67.49,39.23 67.32,39.26
RESET  (via drill 0.6 pad 1.2)
  Top 0.406: U1.29 32.26,13.58 32.26,11.43 30.87,10.04 R6.1 31.52,9.14 v32.26,9.14 | v53.34,13.97 53.34,12.82 S1.3
  Bottom 0.406: v32.26,9.14 50.55,9.14 53.34,11.94 v53.34,13.97
V+  (via drill 0.6 pad 1.2, 0.6 pad 1.5)
  Top 0.406: JP22.4 69.98,16.38 SJ100.1 69.98,21.72 71.12,22.86 73.41,22.86 73.91,23.37 73.91,37.85 v73.41,38.35 | D3.K 22.61,39.12 23.62,40.13 | 23.62,40.13 24.64,41.15 K1.1 38.61,41.15 39.12,40.64 39.12,39.12 39.62,38.61 LED2.A | 23.62,40.13 22.61,40.13 v22.35,40.39
  Top 0.813: v51.31,54.86 51.31,50.86 C13.+ | C10.+ 30.92,54.29 v31.24,54.61
  Top 1.016: C23.+ 77.28,45.4 75.95,46.74 JP21.1 | 31.24,60.45 P2.VMOT | P3.VMOT 51.56,60.2 51.31,60.45
  Top 1.778: v71.63,60.45 51.56,60.45 | 51.56,60.45 51.31,60.45 31.24,60.45 | 31.24,60.45 11.43,60.45 | JP21.1 77.47,51.05 78.49,52.07 78.49,57.4 77.47,58.42 72.64,58.42 71.63,59.18 v71.63,60.45 | 51.56,65.28 68.83,65.28 v69.85,64.26 71.63,62.48 v71.63,60.45 | 51.56,65.28 51.56,60.45 | 51.56,65.28 31.24,65.28 | 31.24,65.28 13.21,65.28 11.43,63.5 11.43,60.45 | 31.24,65.28 31.24,60.45 | 10.92,51.31 P1.VMOT 10.92,59.94 11.43,60.45 | 10.92,51.31 10.92,51.12 C12.+ | 11.18,33.78 K1.S 11.18,33.27 8.89,30.99 3.56,30.99 2.03,32.51 2.03,35.56 | 10.92,51.31 10.67,51.05 2.16,51.05 | 2.16,55.63 3.05,56.64 10.67,56.64
  Top 1.93: K1.S 9.14,35.56 2.16,35.56
  Top 3.81: 2.16,35.56 2.16,51.05 2.16,55.63
  Bottom 0.406: JP22.1 JP22.2 JP22.3 JP22.4 | v73.41,38.35 73.41,40.13 75.95,42.67 JP21.1 | v22.35,40.39 18.03,40.39 K1.S
  Bottom 0.813: P3.VMOT 51.56,55.12 v51.31,54.86 | v31.24,54.61 P2.VMOT
  Bottom 1.778: JP21.1 77.47,51.05 78.49,52.07 78.49,57.4 77.47,58.42 72.64,58.42 71.63,59.18 v71.63,60.45 71.63,62.48 v69.85,64.26
X-MOT-1A
  Bottom 1.016: JP10.3 P1.1A
X-MOT-1A1
  Bottom 1.016: JP2.3 P2.1A
X-MOT-1A2
  Bottom 1.016: JP16.3 P3.1A
X-MOT-1B
  Bottom 1.016: JP10.4 P1.1B
X-MOT-1B1
  Bottom 1.016: JP2.4 P2.1B
X-MOT-1B2
  Bottom 1.016: JP16.4 P3.1B
X-MOT-2A
  Bottom 1.016: JP10.2 P1.2A
X-MOT-2A1
  Bottom 1.016: JP2.2 P2.2A
X-MOT-2A2
  Bottom 1.016: P3.2A JP16.2
X-MOT-2B
  Bottom 1.016: JP10.1 P1.2B
X-MOT-2B1
  Bottom 1.016: P2.2B JP2.1
X-MOT-2B2
  Bottom 1.016: P3.2B JP16.1
X-MS1
  Top 0.406: P1.MS1 14.73,43.69 16.76,43.69 21.84,38.61 21.84,30.23 20.57,28.96 R10.2
  Bottom 0.406: P1.MS1 16.51,48.01 20.32,48.01 21.08,48.77 JP11.1
X-MS2
  Bottom 0.406: P1.MS2 18.29,47.24 22.86,47.24 23.62,48.01 JP12.1
X-MS3
  Bottom 0.406: P1.MS3 20.07,46.48 25.4,46.48 26.16,47.24 JP13.1
X-MS4
  Bottom 0.406: P2.MS2 38.86,47.5 43.18,47.5 43.94,48.26 JP14.1
X-MS5
  Bottom 0.406: P2.MS3 40.64,46.74 45.47,46.74 46.48,47.75 JP15.1
X-MS6  (via drill 0.6 pad 1.2)
  Top 0.406: R8.2 30.58,31.34 31.24,32 33.78,32 34.29,32.51 34.29,38.35 v33.78,38.86
  Bottom 0.406: JP3.1 41.4,49.28 40.39,48.26 37.08,48.26 P2.MS1 v33.78,38.86
X-MS7
  Bottom 0.406: P3.MS2 58.93,47.24 62.99,47.24 64.26,48.51 JP18.1
X-MS8
  Bottom 0.406: P3.MS3 60.71,46.48 65.53,46.48 66.8,47.75 JP19.1
X-MS9
  Top 0.406: P3.MS1 54.1,44.2 52.83,42.93 47.5,42.93 47.24,42.67 47.24,41.4 47.75,40.89 47.75,30.48 47.5,30.23 38.76,30.23 R9.2
  Bottom 0.406: P3.MS1 57.15,48.01 60.71,48.01 61.72,49.02 JP17.1
X-RESETSLEEP
  Bottom 1.016: P1.!SLP P1.!RST
X-RESETSLEEP1
  Bottom 1.016: P2.!SLP P2.!RST
X-RESETSLEEP2
  Bottom 1.016: P3.!SLP P3.!RST

### Text on the board
Top: http://reprap.org/wiki/Cyclone_PCB_Factory | Spindle ON | Stepper Power | C | Z | Bus Power | CYCLNE | X | Ver. 1.0 | GRBL | (c) 2013 | Y | CNTRL | !RST! | 12V | GND | 5V | A0 | A1 | A2 | A3 | A4 | A5 | A6 | A7 | D0 | D1 | D2 | D3 | D4 | D5 | D6 | D7 | D8 | D9 | D10 | D11 | D12 | D13
Bottom: http://reprap.org/wiki/Cyclone_PCB_Factory